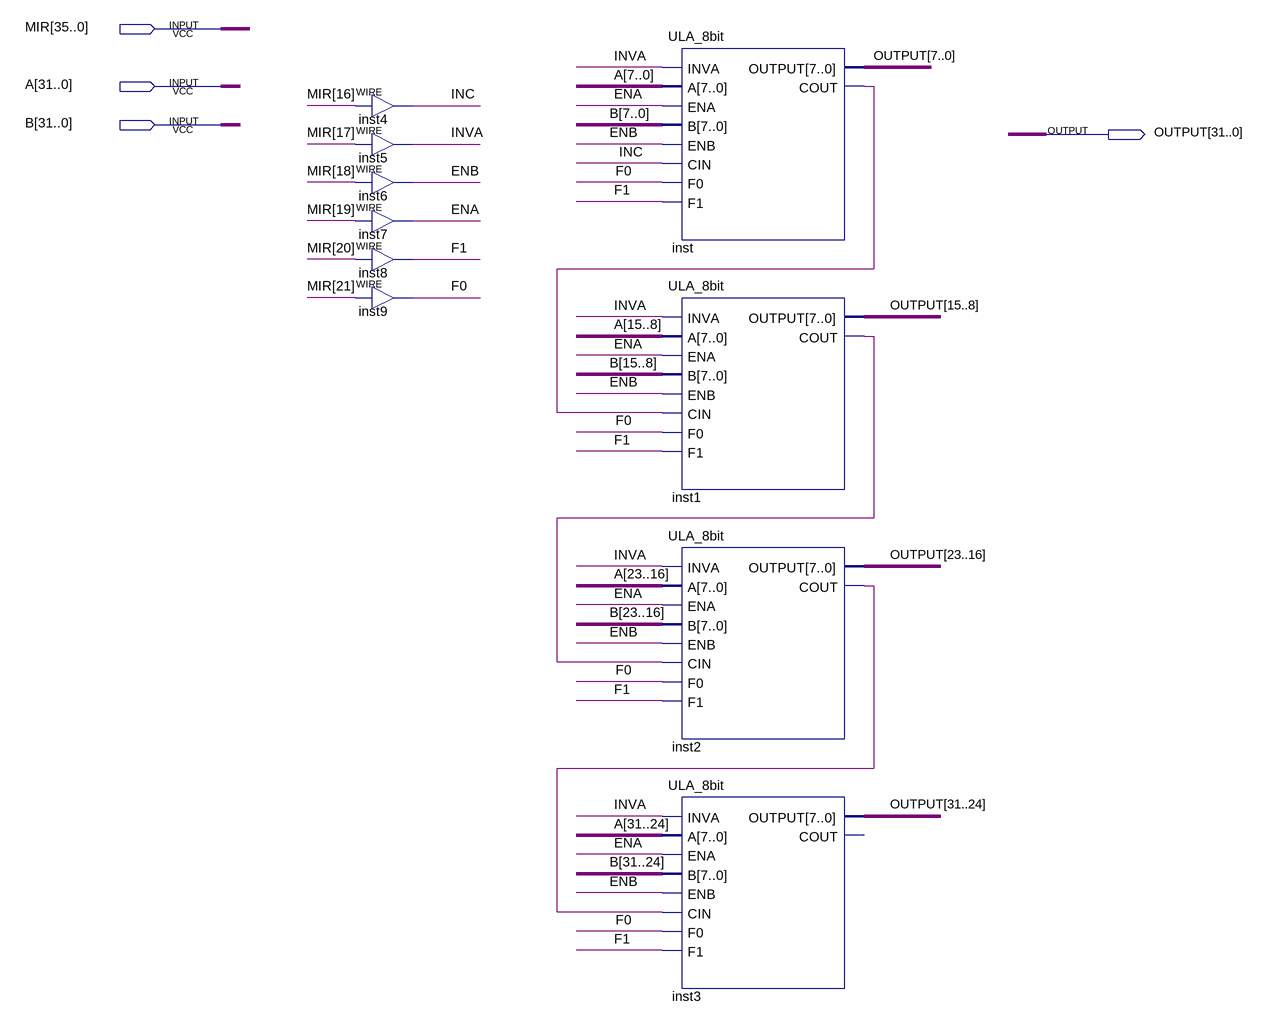
[diagram p0: schematic sheet]
// Quartus schematic ULA_32bit.bdf as structural Verilog: 10 symbols, 4 pins
module ULA_32bit (
  input  [35:0] MIR,
  input  [31:0] A,
  input  [31:0] B,
  output [31:0] OUTPUT
);

  wire ENA, ENB, F0, F1, INC, inst1_cout, inst2_cout, inst_cout, INVA;

  assign INC = MIR[16];  // WIRE inst4
  assign INVA = MIR[17];  // WIRE inst5
  assign ENB = MIR[18];  // WIRE inst6
  assign ENA = MIR[19];  // WIRE inst7
  assign F1 = MIR[20];  // WIRE inst8
  assign F0 = MIR[21];  // WIRE inst9
  ULA_8bit inst (
    .INVA(INVA), .A(A[7:0]), .ENA(ENA), .B(B[7:0]), .ENB(ENB), .CIN(INC), .F0(F0), .F1(F1),
    .OUTPUT(OUTPUT[7:0]), .COUT(inst_cout));
  ULA_8bit inst1 (
    .INVA(INVA), .A(A[15:8]), .ENA(ENA), .B(B[15:8]), .ENB(ENB), .CIN(inst_cout), .F0(F0), .F1(F1),
    .OUTPUT(OUTPUT[15:8]), .COUT(inst1_cout));
  ULA_8bit inst2 (
    .INVA(INVA), .A(A[23:16]), .ENA(ENA), .B(B[23:16]), .ENB(ENB), .CIN(inst1_cout), .F0(F0), .F1(F1),
    .OUTPUT(OUTPUT[23:16]), .COUT(inst2_cout));
  ULA_8bit inst3 (
    .INVA(INVA), .A(A[31:24]), .ENA(ENA), .B(B[31:24]), .ENB(ENB), .CIN(inst2_cout), .F0(F0), .F1(F1),
    .OUTPUT(OUTPUT[31:24]));  // open: COUT
endmodule
